# Altium schematic sheet Sheet3.SchDoc
size A; SheetNumber: 1; SheetTotal: 1
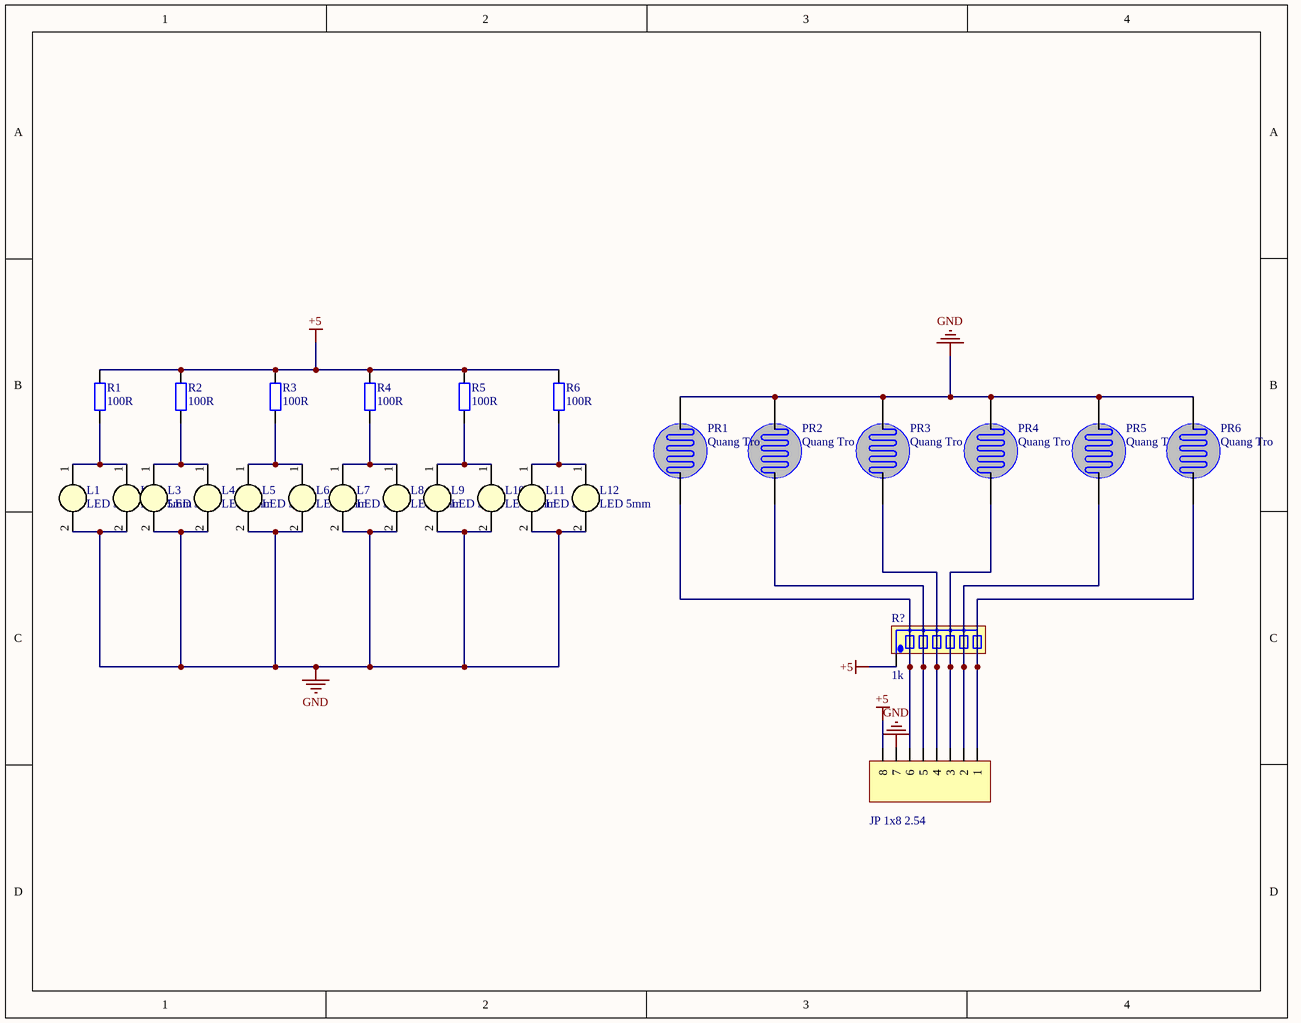
[diagram p0: Sheet3.SchDoc]

## Parts
JP?  JP 1x8 2.54  [JP 1x8 DT]
L1  LED 5mm  [LED-5MM-WHITE]
L2  LED 5mm  [LED-5MM-WHITE]
L3  LED 5mm  [LED-5MM-WHITE]
L4  LED 5mm  [LED-5MM-WHITE]
L5  LED 5mm  [LED-5MM-WHITE]
L6  LED 5mm  [LED-5MM-WHITE]
L7  LED 5mm  [LED-5MM-WHITE]
L8  LED 5mm  [LED-5MM-WHITE]
L9  LED 5mm  [LED-5MM-WHITE]
L10  LED 5mm  [LED-5MM-WHITE]
L11  LED 5mm  [LED-5MM-WHITE]
L12  LED 5mm  [LED-5MM-WHITE]
PR1  Quang Tro  [Quang Tro]
PR2  Quang Tro  [Quang Tro]
PR3  Quang Tro  [Quang Tro]
PR4  Quang Tro  [Quang Tro]
PR5  Quang Tro  [Quang Tro]
PR6  Quang Tro  [Quang Tro]
R1  100R  [tro smd 0805]
R2  100R  [tro smd 0805]
R3  100R  [tro smd 0805]
R4  100R  [tro smd 0805]
R5  100R  [tro smd 0805]
R6  100R  [tro smd 0805]
R?  1k  [tro bang a7]

## Nets
+5: JP?.8 R1.2 R2.2 R3.2 R4.2 R5.2 R6.2 R?.1
GND: JP?.7 L1.2(K) L2.2(K) L3.2(K) L4.2(K) L5.2(K) L6.2(K) L7.2(K) L8.2(K) L9.2(K) L10.2(K) L11.2(K) L12.2(K) PR1.2 PR2.2 PR3.2 PR4.2 PR5.2 PR6.2
NetJP?_1: JP?.1 PR6.1 R?.7
NetJP?_2: JP?.2 PR5.1 R?.6
NetJP?_3: JP?.3 PR4.1 R?.5
NetJP?_4: JP?.4 PR3.1 R?.4
NetJP?_5: JP?.5 PR2.1 R?.3
NetJP?_6: JP?.6 PR1.1 R?.2
NetL1_1: L1.1(A) L2.1(A) R1.1
NetL3_1: L3.1(A) L4.1(A) R2.1
NetL5_1: L5.1(A) L6.1(A) R3.1
NetL7_1: L7.1(A) L8.1(A) R4.1
NetL9_1: L9.1(A) L10.1(A) R5.1
NetL11_1: L11.1(A) L12.1(A) R6.1

## Library data of the parts
JP? = JP 1x8 2.54 Duc Thang: Cắm; Ten_Linh_Kien: Jump Đơn Đực 2.54MM 1x40P Thẳng 11MM; Don_Vi: Con; Ma_Hang: MH000903; Ghi_Chu: *; Kieu_Chan: *; Chung_Loai: Cắm
L1-L12 = LED 5mm Trang: Cắm; Don_Vi: Con; Ma_Hang: MH008983; Ten_Linh_Kien: Led 5MM Trắng Đục (1000c); Ghi_Chu: *; Kieu_Chan: *; Chung_Loai: Cắm
PR1-PR6 = Quang Tro: Photoresistor; Creator: Bien Nguyen
R1-R6 = Tro 0805 5% 100R: Dán; Don_Vi: Con; So_Chan: 2; Ten_Linh_Kien: Trở 0805 5% 100R; Ma_Hang: MH005251; Chung_Loai: Dán; Kieu_Chan: *
R? = Tro Bang A7 1k: Cắm; Don_Vi: Con; So_Chan: 7; Ten_Linh_Kien: Trở Băng A07-102 1K 1/8W 5%; Ma_Hang: MH002004; Chung_Loai: Cắm; Kieu_Chan: *